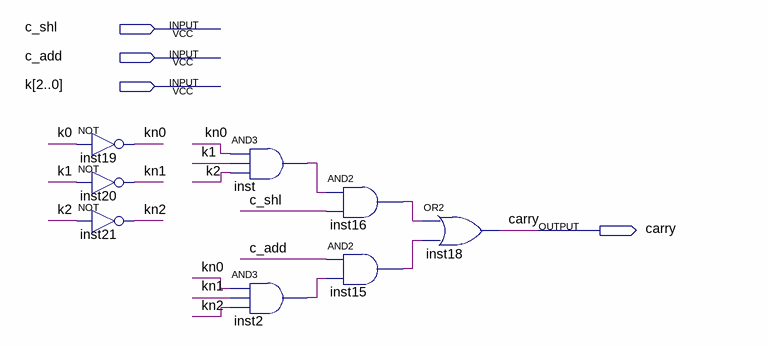
[diagram p0: schematic sheet]
// Quartus schematic carry_check.bdf as structural Verilog: 8 symbols, 4 pins
module carry_check (
  input  c_shl,
  input  c_add,
  input  [2:0] k,
  output carry
);

  wire inst2_out, inst15_out, inst16_out, inst_out, kn0, kn1, kn2;

  not inst19 (kn0, k[0]);
  not inst20 (kn1, k[1]);
  not inst21 (kn2, k[2]);
  and inst (inst_out, kn0, k[1], k[2]);
  and inst2 (inst2_out, kn0, kn1, kn2);
  and inst16 (inst16_out, inst_out, c_shl);
  and inst15 (inst15_out, c_add, inst2_out);
  or inst18 (carry, inst16_out, inst15_out);
endmodule
